# EAGLE design Arduino MEGA shield (EAGLE 5.11)
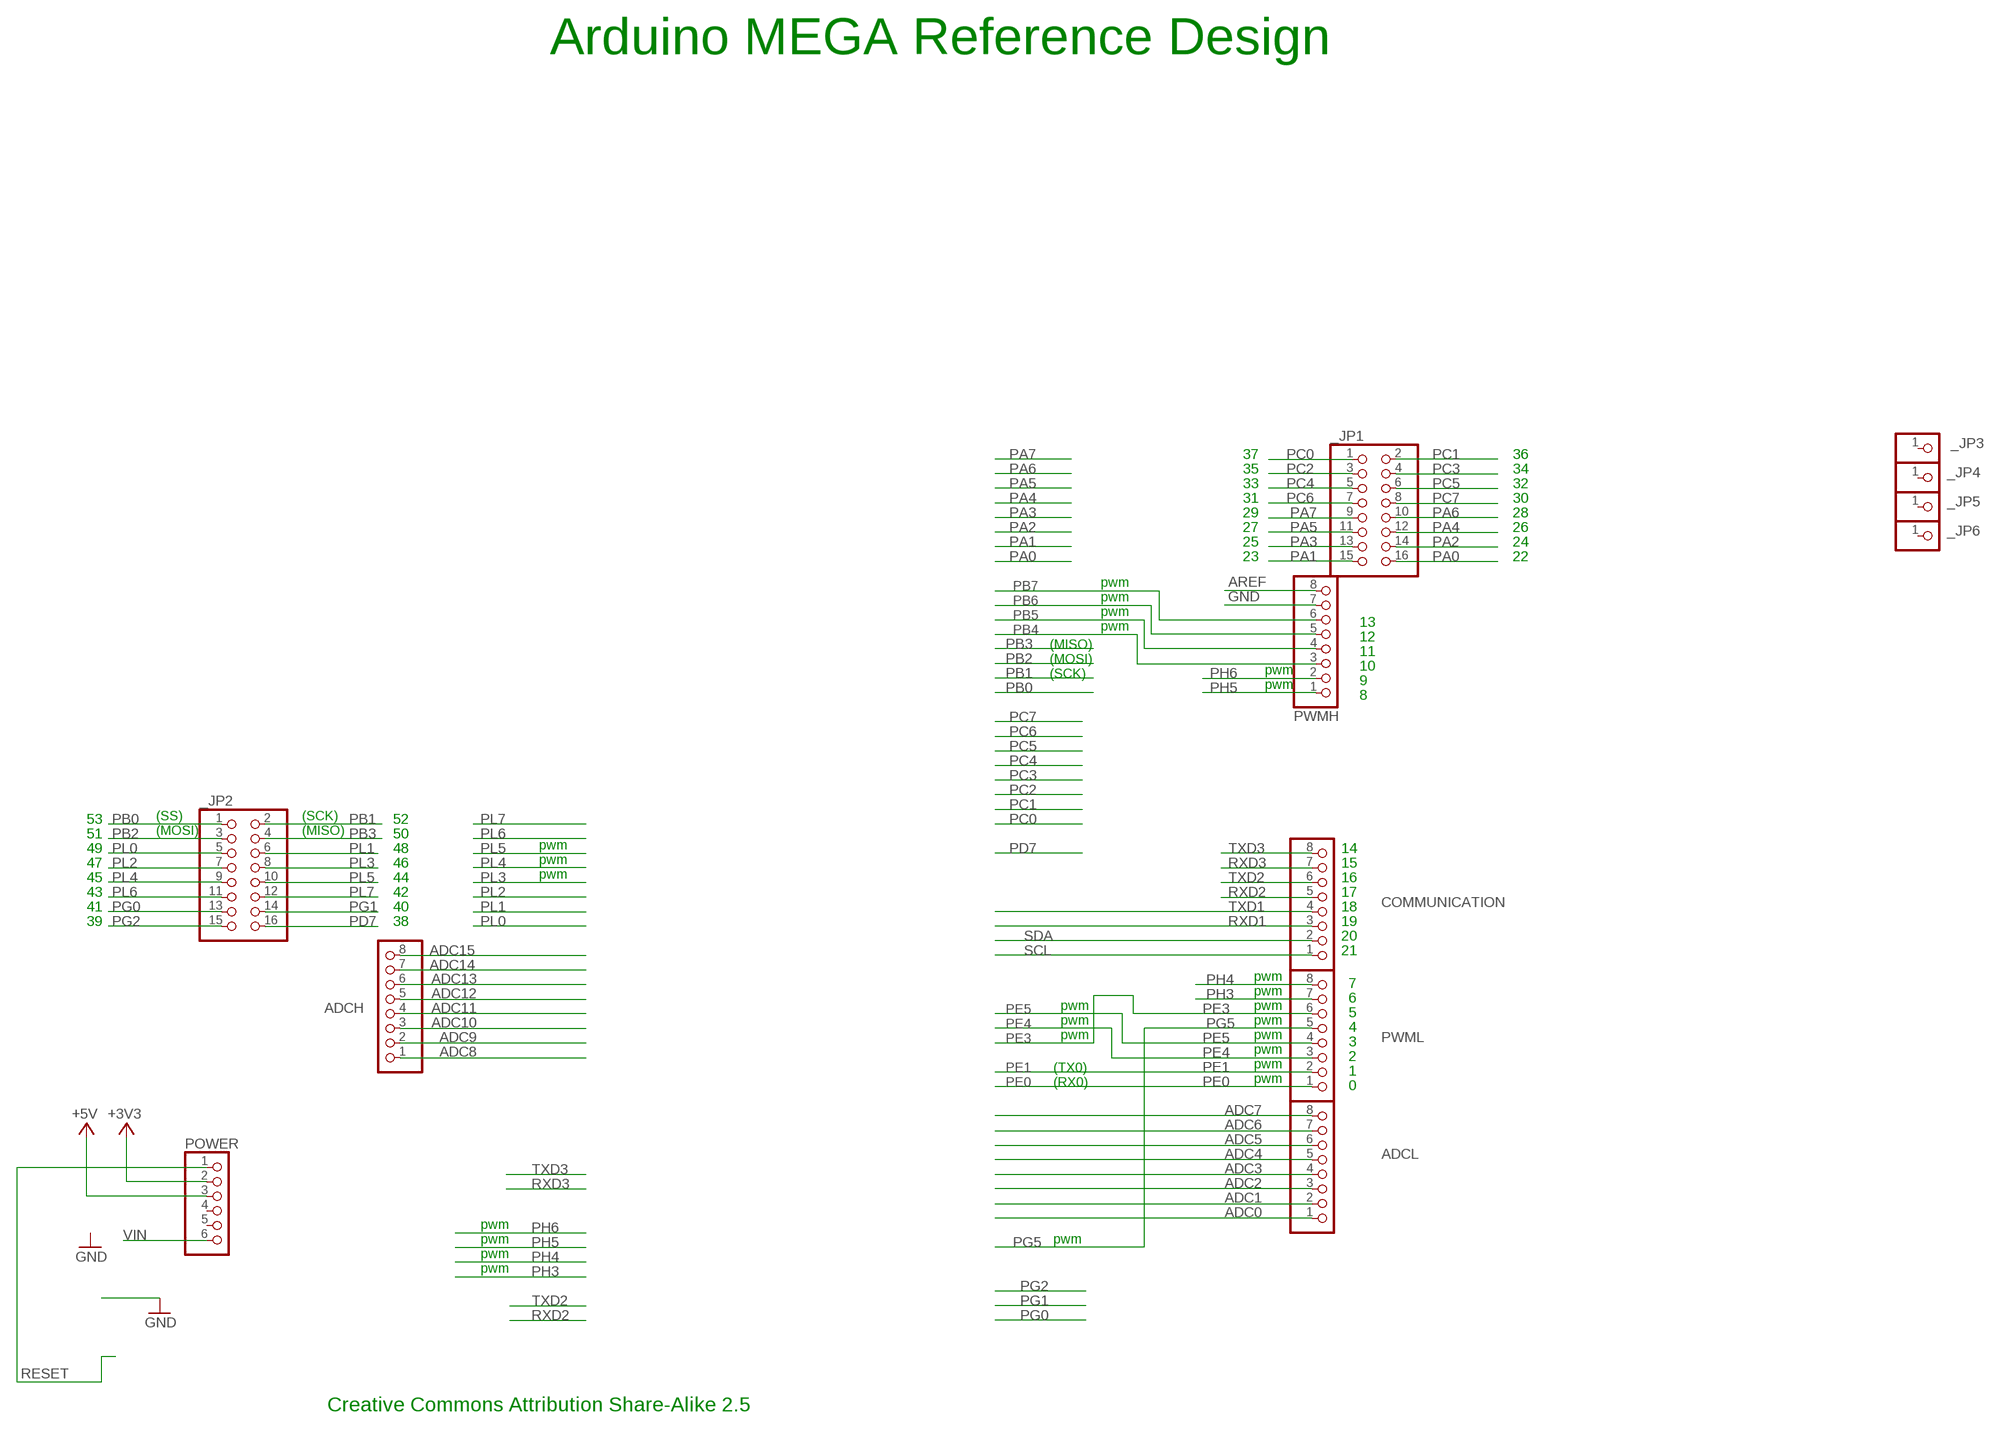
[diagram p0: schematic, sheet 1]

## Parts
_JP1  PINHD-2X8  [2X08]
_JP2  PINHD-2X8  [2X08]
_JP3  PINHD-1X1  [1X01]
_JP4  PINHD-1X1  [1X01]
_JP5  PINHD-1X1  [1X01]
_JP6  PINHD-1X1  [1X01]
ADCH  PINHD-1X8  [1X08]
ADCL  PINHD-1X8  [1X08]
COMMUNICATION  PINHD-1X8  [1X08]
POWER  PINHD-1X6  [1X06]
PWMH  PINHD-1X8  [1X08]
PWML  PINHD-1X8  [1X08]

## Nets
+3V3 [power]: POWER.2
+5V [usbvcc]: POWER.3
ADC0: ADCL.1
ADC1: ADCL.2
ADC2: ADCL.3
ADC3: ADCL.4
ADC4: ADCL.5
ADC5: ADCL.6
ADC6: ADCL.7
ADC7: ADCL.8
ADC8: ADCH.1
ADC9: ADCH.2
ADC10: ADCH.3
ADC11: ADCH.4
ADC12: ADCH.5
ADC13: ADCH.6
ADC14: ADCH.7
ADC15: ADCH.8
AREF: PWMH.8
GND [gnd]: PWMH.7
PA0: _JP1.16
PA1: _JP1.15
PA2: _JP1.14
PA3: _JP1.13
PA4: _JP1.12
PA5: _JP1.11
PA6: _JP1.10
PA7: _JP1.9
PB0: _JP2.1
PB1: _JP2.2
PB2: _JP2.3
PB3: _JP2.4
PB4: PWMH.3
PB5: PWMH.4
PB6: PWMH.5
PB7: PWMH.6
PC0: _JP1.1
PC1: _JP1.2
PC2: _JP1.3
PC3: _JP1.4
PC4: _JP1.5
PC5: _JP1.6
PC6: _JP1.7
PC7: _JP1.8
PD7: _JP2.16
PE0: PWML.1
PE1: PWML.2
PE3: PWML.6
PE4: PWML.3
PE5: PWML.4
PG0: _JP2.13
PG1: _JP2.14
PG2: _JP2.15
PG5: PWML.5
PH3: PWML.7
PH4: PWML.8
PH5: PWMH.1
PH6: PWMH.2
PL0: _JP2.5
PL1: _JP2.6
PL2: _JP2.7
PL3: _JP2.8
PL4: _JP2.9
PL5: _JP2.10
PL6: _JP2.11
PL7: _JP2.12
RESET: POWER.1
RXD1: COMMUNICATION.3
RXD2: COMMUNICATION.5
RXD3: COMMUNICATION.7
SCL: COMMUNICATION.1
SDA: COMMUNICATION.2
TXD1: COMMUNICATION.4
TXD2: COMMUNICATION.6
TXD3: COMMUNICATION.8
VIN [power]: POWER.6
Unconnected: _JP3.1 _JP4.1 _JP5.1 _JP6.1 POWER.4 POWER.5

## Notes on the sheet
- Arduino MEGA Reference Design
- 37 | 36
- 35 | 34
- 33 | 32
- 31 | 30
- 29 | 28
- 27 | 26
- 25 | 24
- 23 | 22
- pwm
- pwm
- pwm
- pwm | 13
- 12
- (MISO)
- 11
- (MOSI)
- pwm | 10
- (SCK)
- pwm | 9
- 8
- 53 | (SS) | (SCK) | 52
- 51 | (MOSI) | (MISO) | 50
- 49 | 48 | pwm | 14
- 47 | 46 | pwm | 15
- 45 | 44 | pwm | 16
- 43 | 42 | 17
- 41 | 40 | 18
- 39 | 38 | 19
- 20
- 21
- pwm
- 7
- pwm
- 6
- pwm | pwm
- 5
- pwm | pwm
- 4
- pwm | pwm
- 3
- pwm
- 2
- (TX0) | pwm
- 1
- (RX0) | pwm
- 0
- pwm
- pwm | pwm
- pwm
- pwm
- Creative Commons Attribution Share-Alike 2.5

## Library data of the parts
_JP1 _JP2 = pinhead:PINHD-2X8: PIN HEADER
_JP3-_JP6 = pinhead:PINHD-1X1: PIN HEADER
ADCH ADCL COMMUNICATION PWMH PWML = pinhead:PINHD-1X8: PIN HEADER
POWER = pinhead:PINHD-1X6: PIN HEADER

## Net classes
0 default: width 0.203 mm, drill 0.406 mm, clearance 0.203 mm
1 power: width 0.61 mm, drill 0.711 mm, clearance 0.203 mm
2 gnd: width 0.305 mm, drill 0.711 mm, clearance 0.203 mm
3 usbvcc: width 0.508 mm, drill 0.711 mm, clearance 0.203 mm

## Board
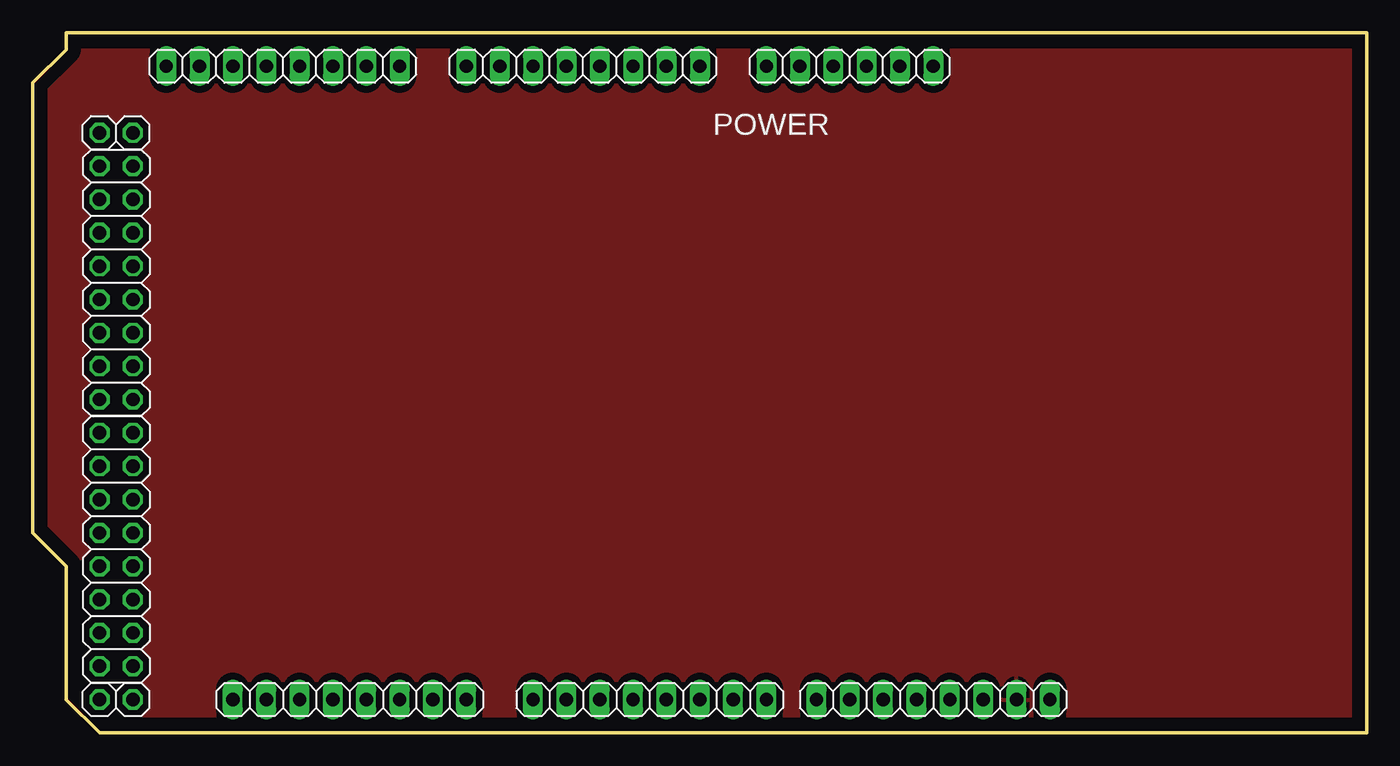
[diagram p1: board, top side]

Size 101.6 x 53.34 mm. Coordinates in mm from the lower left corner, seen from the top.
Outline: 101.6,0 5.08,0 2.54,2.54 2.54,12.7 0,15.24 0,49.53 2.54,52.07 2.54,53.34 101.6,53.34 101.6,0
Copper layers (1*16): Top 0.035mm / dielectric 1.5mm / Bottom 0.035mm
Design rules "default *": minimum track width 8mil, minimum drill 16mil, track to track 8mil, track to pad 8mil, pad to pad 8mil, via to via 10mil, smd to smd 8mil, copper to edge 40mil, drill to drill 12mil, minimum pad ring 10mil, minimum via ring 10mil, stop-mask expansion 4mil, vias tented up to drill 0mil, thermal gap 10mil

### Footprints (pad centres in the part's own frame; a part is rotated, then mirrored left to right if it is on the bottom)
2X08 = drill 1.016 octagon: 1 -8.89,-1.27; 2 -8.89,1.27; 3 -6.35,-1.27; 4 -6.35,1.27; 5 -3.81,-1.27; 6 -3.81,1.27; 7 -1.27,-1.27; 8 -1.27,1.27; 9 1.27,-1.27; 10 1.27,1.27; 11 3.81,-1.27; 12 3.81,1.27; 13 6.35,-1.27; 14 6.35,1.27; 15 8.89,-1.27; 16 8.89,1.27
1X01 = drill 1.016 octagon: 1 0,0
1X08 = drill 1.016 long: 1 -8.89,0; 2 -6.35,0; 3 -3.81,0; 4 -1.27,0; 5 1.27,0; 6 3.81,0; 7 6.35,0; 8 8.89,0
1X06 = drill 1.016 long: 1 -6.35,0; 2 -3.81,0; 3 -1.27,0; 4 1.27,0; 5 3.81,0; 6 6.35,0

### Placement (x,y rotation side)
_JP1  6.35,13.97 270 top
_JP2  6.35,34.29 270 top
_JP3  7.62,2.54 180 top
_JP4  5.08,2.54 180 top
_JP5  7.62,45.72 180 top
_JP6  5.08,45.72 180 top
ADCH  19.05,50.8 180 top
ADCL  41.91,50.8 180 top
COMMUNICATION  24.13,2.54 0 top
POWER  62.23,50.8 180 top
PWMH  68.58,2.54 0 top
PWML  46.99,2.54 0 top

### Tracks (layer width: path | path; a pad name or v marks a point on that pad's centre or on a via)
GND
  pour Top (isolate 0.508, rank 2): 100.97,0.63 0,0.63 0,52.7 100.97,52.7